# EAGLE design MeteoSensor (EAGLE 9.6.2)
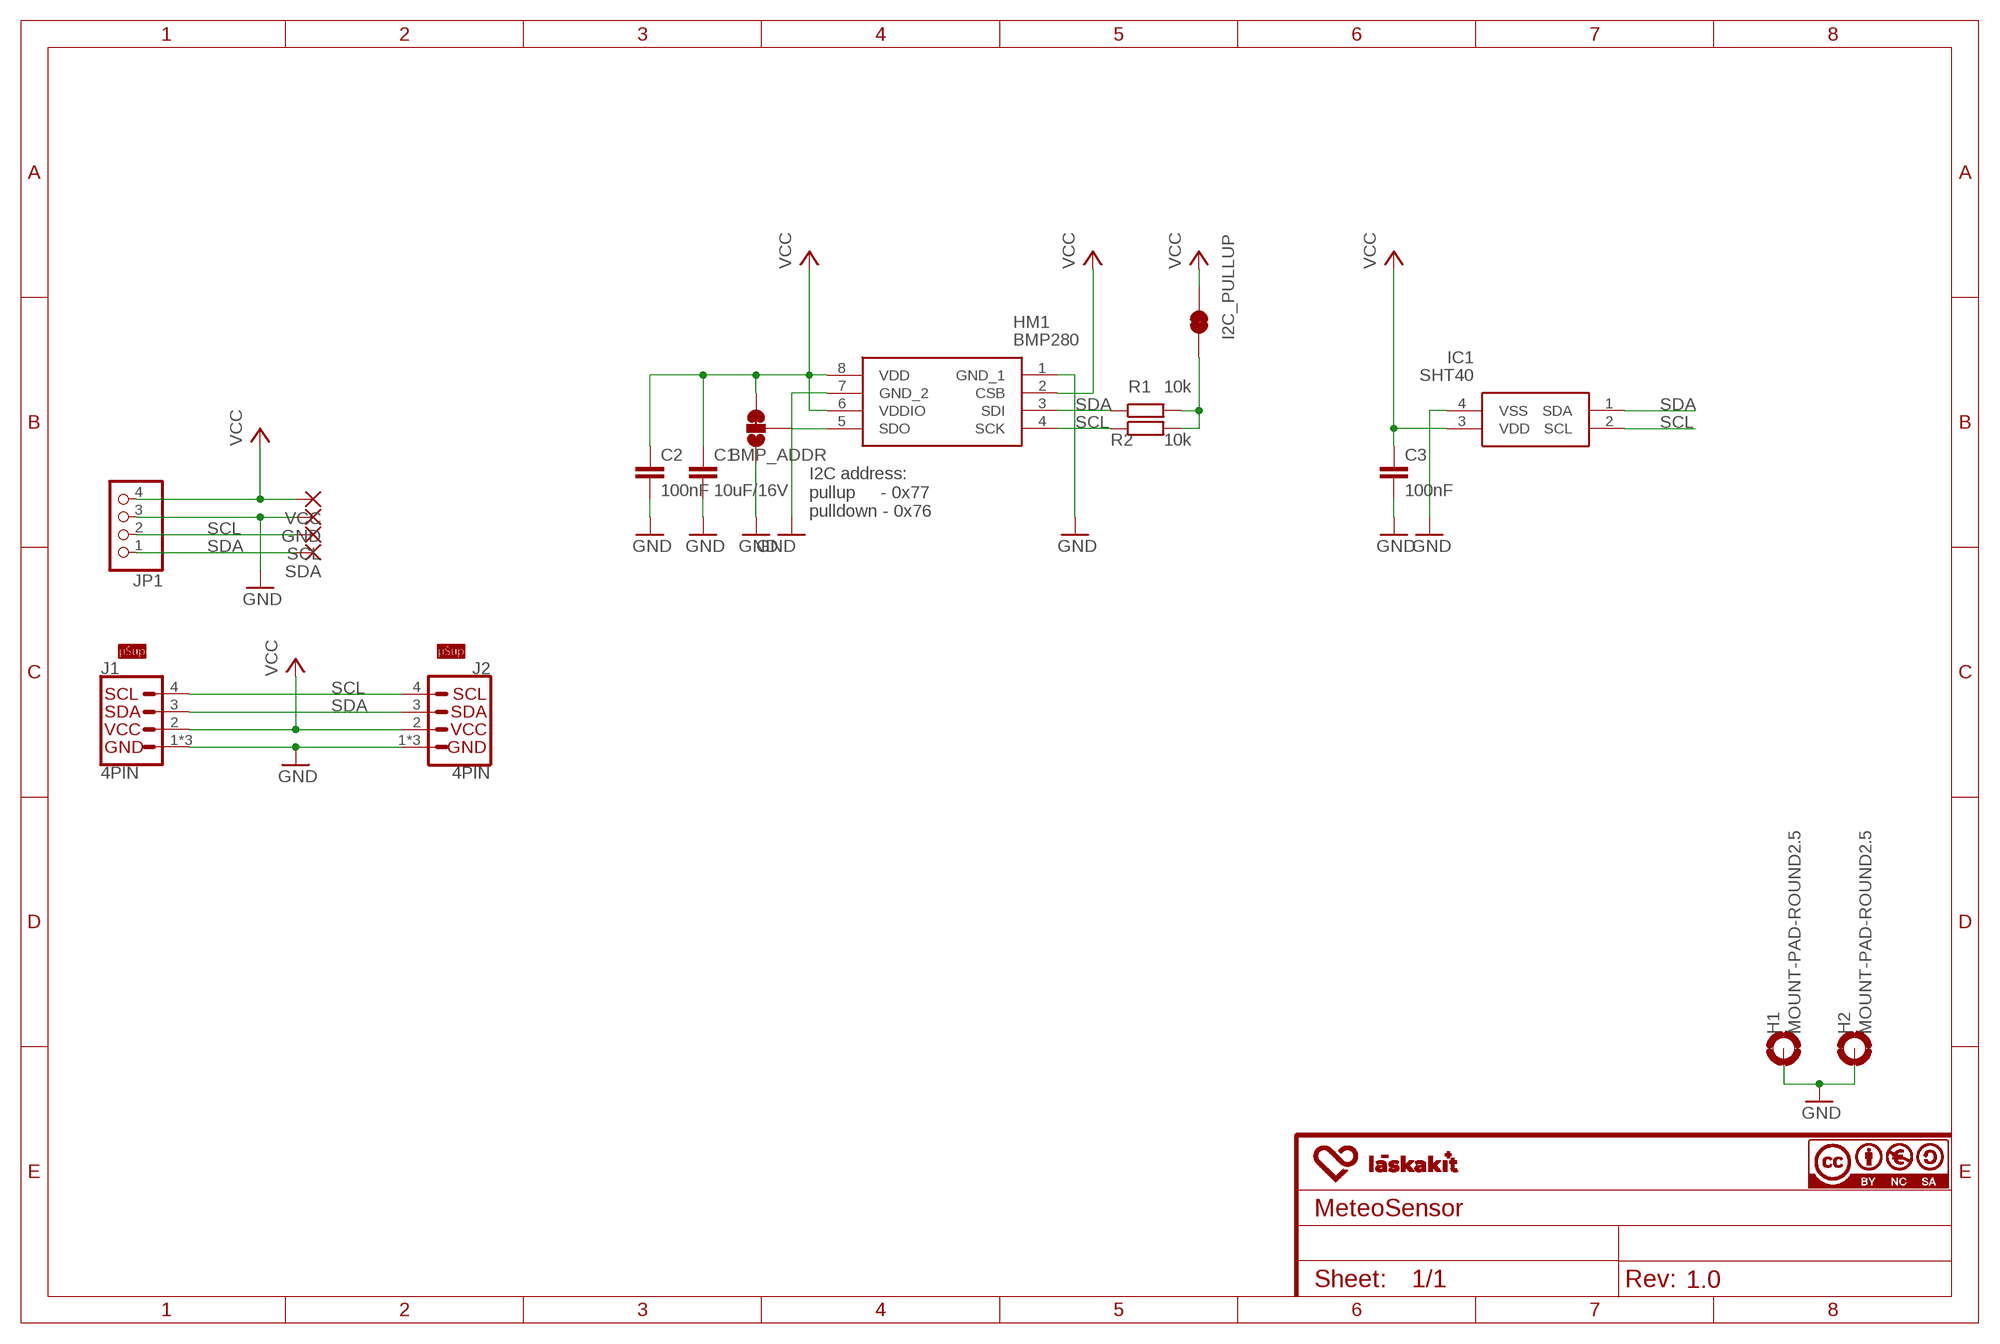
[diagram p0: schematic, sheet 1]
FRAME1 (FRAME-A4L): CREVISION: 1.0

## Parts
BMP_ADDR  JUMPER-SMT_3_1-NC_TRACE_NO-SILK  [SMT-JUMPER_3_1-NC_TRACE_NO-SILK]
C1  10uF/16V  CAPACITOR_0402  [C0402]
C2  100nF  CAPACITOR_0402  [C0402]
C3  100nF  CAPACITOR_0402  [C0402]
GND  WIREPADSMD2,54-5,08  [SMD2,54-5,08]
H1  MOUNT-PAD-ROUND2.5  [2,5-PAD]
H2  MOUNT-PAD-ROUND2.5  [2,5-PAD]
HM1  BMP280  [BMP280]
I2C_PULLUP  JUMPER-SMT_2_NC_TRACE_NO-SILK  [SMT-JUMPER_2_NC_TRACE_NO-SILK]
IC1  SHT40  [SHT40]
J1  4PIN  USUP_I2C_CONNECTOR_HOR  [1X04_1MM_RA]
J2  4PIN  USUP_I2C_CONNECTOR_HOR  [1X04_1MM_RA]
JP1  PINHD-1X4  [1X04]
R1  10k  R-EU_R0402  [R0402]
R2  10k  R-EU_R0402  [R0402]
SCL  WIREPADSMD2,54-5,08  [SMD2,54-5,08]
SDA  WIREPADSMD2,54-5,08  [SMD2,54-5,08]
U$1  USUP_LOGO  [USUP_4MM_SILKSCREEN]
U$4  USUP_LOGO  [USUP_4MM_SILKSCREEN]
VCC  WIREPADSMD2,54-5,08  [SMD2,54-5,08]

## Nets
GND: BMP_ADDR.1 C1.2 C2.2 C3.2 GND.1(P) H1.1(MOUNT) H2.1(MOUNT) HM1.1(GND_1) HM1.7(GND_2) IC1.4(VSS) J1.1(GND) J1.NC1(GND) J1.NC2(GND) J2.1(GND) J2.NC1(GND) J2.NC2(GND) JP1.3
N$1: BMP_ADDR.2 HM1.5(SDO)
N$2: I2C_PULLUP.1 R1.2 R2.2
N$3: HM1.2(CSB) ; supply symbol labelled VCC
SCL: HM1.4(SCK) IC1.2(SCL) J1.4(SCL) J2.4(SCL) JP1.2 R2.1 SCL.1(P)
SDA: HM1.3(SDI) IC1.1(SDA) J1.3(SDA) J2.3(SDA) JP1.1 R1.1 SDA.1(P)
VCC: BMP_ADDR.3 C1.1 C2.1 C3.1 HM1.6(VDDIO) HM1.8(VDD) I2C_PULLUP.2 IC1.3(VDD) J1.2(VCC) J2.2(VCC) JP1.4 VCC.1(P)

## Notes on the sheet
- I2C address:
  pullup     - 0x77
  pulldown - 0x76

## Library data of the parts
BMP_ADDR = LaskaKit-Jumpers:JUMPER-SMT_3_1-NC_TRACE: Normally closed trace jumper (1 of 2 connections) This jumper has a trace between two pads so it's normally closed (NC). The other connection is normally open (NO). Use a razor knife to open the connection. For best results follow the IPC guidelines for cutting traces: Cutout at least 0.063 mm (0.005 in). Remove all loose material to clean up the cut area. Seal the cut with an approved epoxy. Reapply solder to reclose the connection, or to close the NO connection.
C1-C3 = LasKKIT-Passive:CAPACITOR
GND SCL SDA VCC = wirepad:WIREPAD: Wire PAD connect wire on PCB
H1 H2 = LasKKit-Holes:MOUNT-PAD-ROUND: MOUNTING PAD, round
HM1 = LasKKit-Sensors:BMP280: Digital Pressure Sensor Source: Datasheet <https://datasheet.datasheetarchive.com/originals/distributors/DKDS-24/462913.pdf>; ARROW_PART_NUMBER: BMP280; ARROW_PRICE-STOCK: https://www.arrow.com/en/products/bmp280/bosch; DESCRIPTION: Digital Pressure Sensor; HEIGHT: mm; MANUFACTURER_NAME: Bosch Sensortec; MANUFACTURER_PART_NUMBER: bmp280; MOUSER_PART_NUMBER: 262-BMP280; MOUSER_PRICE-STOCK: https://www.mouser.co.uk/ProductDetail/Bosch-Sensortec/BMP280?qs=QhAb4EtQfbUP9Z%252BCHM3Wyg%3D%3D
I2C_PULLUP = LaskaKit-Jumpers:JUMPER-SMT_2_NC_TRACE: Normally closed trace jumper This jumper has a trace between two pads so it's normally closed (NC). Use a razor knife to open the connection. For best results follow the IPC guidelines for cutting traces: Cutout at least 0.063 mm (0.005 in). Remove all loose material to clean up the cut area. Seal the cut with an approved epoxy. Reapply solder to reclose the connection.
IC1 = LasKKit-Sensors:SHT40: HUM&TEMP SENSOR I2C SMD +/-1.8%RH Source: Datasheet <https://www.sensirion.com/fileadmin/user_upload/customers/sensirion/Dokumente/2_Humidity_Sensors/Datasheets/Sensirion_Humidity_Sensors_SHT4x_Datasheet.pdf>; DESCRIPTION: HUM&TEMP SENSOR I2C SMD +/-1.8%RH; HEIGHT: 0.59mm; MANUFACTURER_NAME: Sensirion; MANUFACTURER_PART_NUMBER: SHT40
J1 J2 = LasKKit-Connectors:USUP_I2C_CONNECTOR: LaskaKit I2C Standard μŠup Connector An SMD 1mm pitch JST connector makes it easy and quick (Šup) to connect I2C devices to each other. The μŠup system enables fast and solderless connection between popular platforms and various sensors and actuators.; LCSC_PART_RIGHT: C145956; LCSC_PART_VERT: C371588
JP1 = LasKKit-Connectors:PINHD-1X4: PIN HEADER
R1 R2 = rcl:R-EU_: RESISTOR, European symbol; SPICEPREFIX: R
U$1 U$4 = LasKKit-Aesthetics:USUP_LOGO

## Board
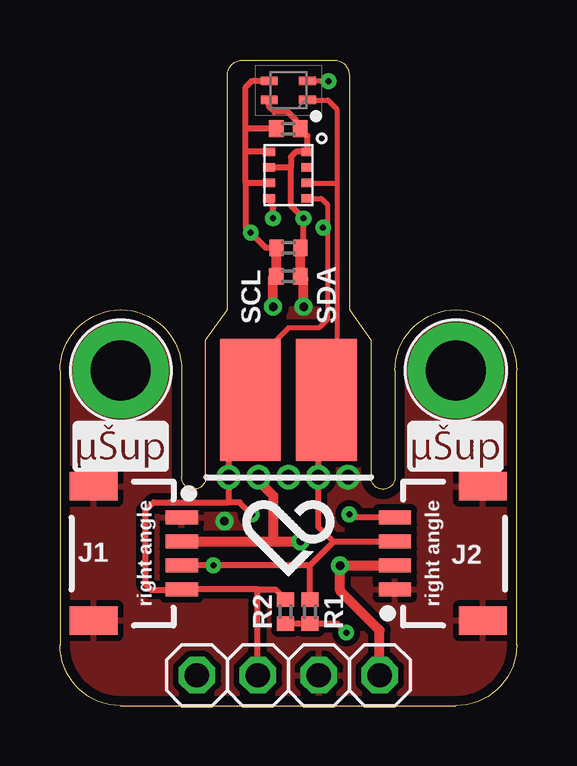
[diagram p1: board, top side]
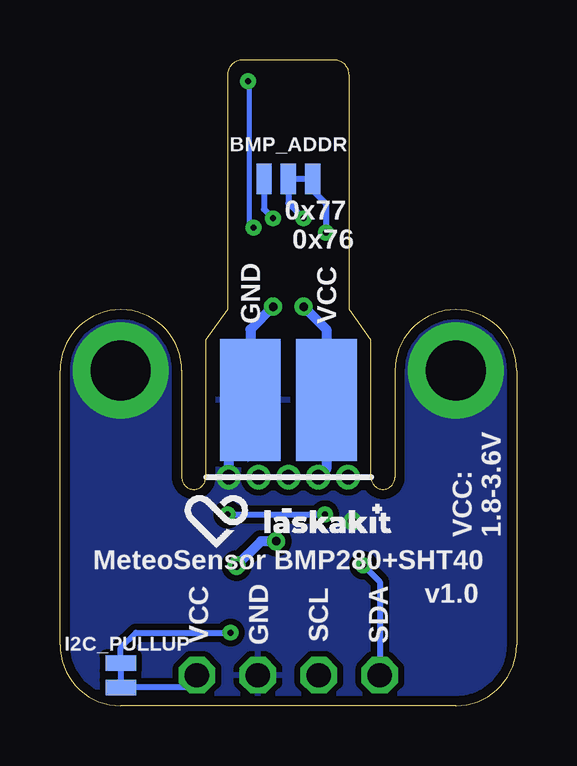
[diagram p2: board, bottom side, seen from below]

Size 19.05 x 26.92 mm. Coordinates in mm from the lower left corner, seen from the top.
Outline: 2.54,0 16.51,0 arc90 19.05,2.54 19.05,13.97 arc90 16.51,16.51 arc90 13.97,13.97 13.97,9.53 arc-180 12.97,9.53 12.97,15.24 12.07,16.51 12.07,26.29 arc90 11.43,26.92 7.62,26.92 arc90 6.99,26.29 6.99,16.51 6.08,15.24 6.08,9.53 arc-180 5.08,9.53 5.08,13.97 arc90 2.54,16.51 arc90 0,13.97 0,2.54 arc90 2.54,0
Copper layers (1*16): Top 0.035mm / dielectric 1.5mm / Bottom 0.035mm
Design rules "LaskaKit_DRC": minimum track width 6mil, minimum drill 0.2mm, track to track 5mil, track to pad 8mil, pad to pad 6mil, via to via 8mil, smd to smd 6mil, copper to edge 16mil, drill to drill 20mil, minimum pad ring 10mil, minimum via ring 8mil, stop-mask expansion 3mil, vias tented up to drill 24mil, thermal gap 10mil

### Footprints (pad centres in the part's own frame; a part is rotated, then mirrored left to right if it is on the bottom)
SMT-JUMPER_3_1-NC_TRACE_NO-SILK = smd 0.635 x 1.27: 1 -1.016,0; 2 0,0; 3 1.016,0
C0402 = smd 0.6 x 0.7: 1 -0.5,0; 2 0.5,0
SMD2,54-5,08 = smd 2.54 x 5.08: 1 0,0
2,5-PAD = drill 2.5 pad 4: 1 0,0
BMP280 = smd 0.5 x 0.35: 1 0.8,0.975; 2 0.8,0.325; 3 0.8,-0.325; 4 0.8,-0.975; 5 -0.8,-0.975; 6 -0.8,-0.325; 7 -0.8,0.325; 8 -0.8,0.975
SMT-JUMPER_2_NC_TRACE_NO-SILK = smd 0.635 x 1.27: 1 -0.508,0; 2 0.508,0
SHT40 = smd 0.7 x 0.35: 1 -0.8,0.4; 2 -0.8,-0.4; 3 0.8,-0.4; 4 0.8,0.4
1X04_1MM_RA = smd 0.6 x 1.35: 1 1.5,-1.555; 2 0.5,-1.555; 3 -0.5,-1.555; 4 -1.5,-1.555 | smd 1.2 x 2: NC1 -2.8,2.12; NC2 2.8,2.12
1X04 = drill 1.016 octagon: 1 -3.81,0; 2 -1.27,0; 3 1.27,0; 4 3.81,0
R0402 = smd 0.6 x 0.7: 1 -0.5,0; 2 0.5,0

### Placement (x,y rotation side)
BMP_ADDR  9.53,21.97 0 bottom
C1  9.53,17.91 0 top
C2  9.53,19.09 0 top
C3  9.53,24.05 0 top
GND  11.11,12.75 0 bottom
H1  16.51,13.97 0 top
H2  2.54,13.97 0 top
HM1  9.53,22.12 0 top
I2C_PULLUP  16.51,1.27 270 bottom
IC1  9.53,25.65 180 top
J1  3.53,6.35 90 top
J2  15.53,6.35 270 top
JP1  9.53,1.27 0 top
R1  10.43,3.92 270 top
R2  9.41,3.92 270 top
SCL  7.94,12.75 0 top
SDA  11.11,12.75 0 top
U$1  2.54,10.79 0 top
U$2  LASKAKIT_HEART  [LASKAKIT_HEART_4MM]  9.53,6.98 0 top
U$3  [LASKKIT_10MM_SILKSCREEN]  9.53,7.62 0 bottom
U$4  16.51,10.79 0 top
VCC  7.94,12.75 0 bottom

### Tracks (layer width: path | path; a pad name or v marks a point on that pad's centre or on a via)
GND  (via drill 0.25, 0.35, 0.6)
  Top 0.254: C2.2 10.16,19.11 v10.16,20.32 9.63,20.85 9.63,22.45 | HM1.7 9.63,22.45 | 9.63,22.45 9.63,22.89 9.84,23.1 HM1.1 10.33,23.75 C3.2 9.86,24.22 9.86,24.39 9.49,24.76 8.94,24.76 8.72,24.97 IC1.4
  Top 0.406: v10.16,16.64 10.16,17.77 C1.2 C2.2
  Bottom 0.254: v10.16,20.32 10.54,20.7 BMP_ADDR.1
  Bottom 0.406: v12.02,9.53 12.02,10.84 11.11,11.75 GND.1 11.11,15.68 v10.16,16.64
  other vias: 6.86,7.7
  pour Top (isolate 0.254): 0,-0.08 0,16.54 19.05,16.54 19.05,-0.08
  pour Bottom (isolate 0.254): 0,-0.08 0,16.51 5.39,16.51 6.78,15.12 12.23,15.12 13.62,16.52 19.05,16.51 19.05,-0.08
N$1  (via drill 0.25)
  Top 0.254: v8.89,20.32 8.89,20.76 HM1.5
  Bottom 0.254: BMP_ADDR.2 9.53,20.95 v8.89,20.32
N$2  (via drill 0.25)
  Top 0.254: R2.2 R1.2 11.56,3.42 v11.94,3.05
  Bottom 0.254: v11.94,3.05 15.88,3.05 16.51,2.41 I2C_PULLUP.1
N$4  (via drill 0.6)
  other vias: 9.53,9.53
SCL  (via drill 0.25, 0.6)
  Top 0.152: 7.95,14.17 7.95,12.76 SCL.1
  Top 0.203: 11.15,19.94 11.15,20.9 10.9,21.15 HM1.4 | 11.15,19.94 11.15,16.1 10.79,15.75 9.53,15.75 7.95,14.17 | IC1.2 11.19,26.05 v11.2,26.04 | v10.97,19.93 v10.98,19.94 11.15,19.94
  Top 0.254: 8.26,4.85 8.98,4.85 R2.1 | 8.26,4.85 J1.4 5.06,4.83 3.81,4.83 3.56,5.08 3.56,8.13 3.91,8.48 7.04,8.48 | JP1.2 8.25,4.84 8.26,4.85 | v8,7.98 7.49,8.48 7.04,8.48 | J2.4 12.19,7.85 v12.07,7.98 | SCL.1 7.04,11.85 v7.04,9.53 7.04,8.48
  Bottom 0.203: v10.97,19.93 v10.98,19.93 11.16,20.12 11.16,26 v11.2,26.04
  Bottom 0.254: v12.07,7.98 v8,7.98
SDA  (via drill 0.25, 0.6)
  Top 0.152: SDA.1 11.11,12.76
  Top 0.203: 11.11,12.76 11.56,13.21 11.56,21.84 | IC1.1 11.17,25.25 11.56,24.87 11.56,21.84 | HM1.3 11.51,21.8 11.56,21.84
  Top 0.254: 10.43,5.85 v6.4,5.85 J1.3 | 11.43,6.85 11.38,6.85 10.77,7.46 v10.77,9.53 10.77,11.4 11.11,11.75 SDA.1 | 11.43,6.85 J2.3 | 11.43,6.85 10.43,5.85 | R1.1 10.43,5.85
  Bottom 0.254: v6.4,5.85 5.71,5.16 JP1.1
VCC  (via drill 0.25, 0.35, 0.6)
  Top 0.254: C2.1 8.6,19.09 v7.96,19.73 7.75,19.93 7.75,21.8 | HM1.6 7.75,21.8 | 7.75,21.8 7.75,23.11 | HM1.8 7.76,23.1 7.75,23.11 | IC1.3 8.02,26.05 7.75,25.78 7.75,24.05 | 7.75,23.11 7.75,24.05 | C3.1 7.75,24.05
  Top 0.406: J1.2 8.89,6.85 | 8.89,6.85 v10.03,6.85 v10.03,6.86 | J2.2 13.96,5.84 v11.68,5.84 11.68,4.8 13.33,3.15 JP1.4 | v8.28,9.53 8.28,9.37 8.89,8.76 8.89,6.85 | v8.89,16.64 8.89,17.89 C1.1 C2.1
  Bottom 0.254: I2C_PULLUP.2 16.5,0.78 13.83,0.78 JP1.4 | v7.96,19.73 7.96,20.94 8.51,21.49 BMP_ADDR.3
  Bottom 0.406: v10.03,6.86 10.67,6.86 v11.68,5.84 | v8.28,9.53 7.94,9.87 VCC.1 7.94,15.68 v8.89,16.64

### Text on the board
bNames: 0x77 / 0x76 | VCC: / 1.8-3.6V | MeteoSensor BMP280+SHT40 | v1.0 | VCC / / GND / / SCL / / SDA